# Altium project PCB_Power_S_M_Part.PrjPcb
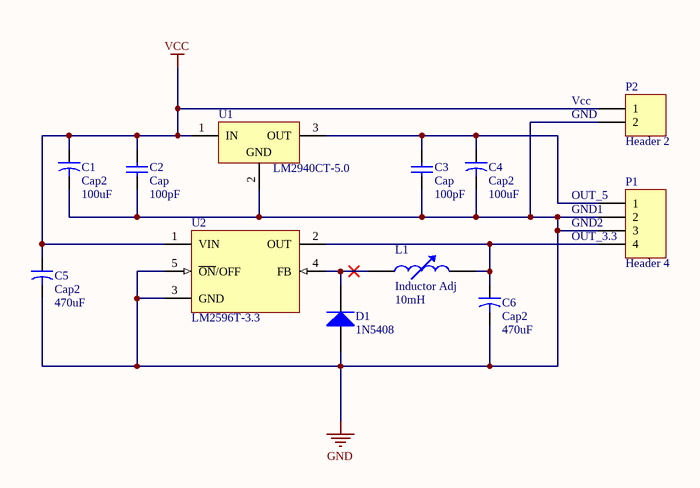
[diagram p0: Sheet1.SchDoc]
1 sheet, 12 parts. Net scope: global (net labels, ports and power ports of the same name join across sheets).

## Sheet Sheet1.SchDoc
size A4

### Parts
C1  Cap2  value 100uF  [CAPR5-4X5]
C2  Cap  value 100pF  [RAD-0.3]
C3  Cap  value 100pF  [RAD-0.3]
C4  Cap2  value 100uF  [CAPR5-4X5]
C5  Cap2  value 470uF  [CAPR5-4X5]
C6  Cap2  value 470uF  [CAPR5-4X5]
D1  1N5408  [DO-201AD]
L1  Inductor Adj  value 10mH  [AXIAL-0.8]
P1  Header 4  [HDR1X4]
P2  Header 2  [HDR1X2]
U1  LM2940CT-5.0  [T03B]
U2  LM2596T-3.3  [T05D]

### Nets
GND: C1.2 C2.1 C3.1 C4.2 C5.2 C6.2 D1.1(A) P1.2 P1.3 P2.2 U1.2(GND) U2.3(GND) U2.5(~{ON}/OFF)
VCC: C1.1 C2.2 C5.1 P2.1 U1.1(IN) U2.1(VIN)
NetC3_2: C3.2 C4.1 P1.1 U1.3(OUT)
NetC6_1: C6.1 L1.2 P1.4 U2.2(OUT)
NetD1_2: D1.2(K) L1.1 U2.4(FB)

### Notes on the sheet
- (near P2) Vcc
- (near P2) GND
- (near P1) GND1
- (near P1) OUT_5
- (near P1) GND2
- (near P1) OUT_3.3

### Library data of the parts
C1 C4-C6 = Cap2: Capacitor; Published: 23-Sep-2002; PackageReference: CAPR5-4X5; Publisher: Altium Limited; PackageDescription: Capacitor; 2 Leads
C2 C3 = Cap: Capacitor; Published: 8-Jun-2000; LatestRevisionDate: 17-Jul-2002; LatestRevisionNote: Re-released for DXP Platform.; PackageReference: RAD-0.3; Publisher: Altium Limited; PackageDescription: Radial Cap, Thru-Hole; 2 Leads; 0.3 in Pin Spacing
D1 = 1N5408: 3 Amp Medium Power Silicon Rectifier Diode; Published: 8-Jun-2000; LatestRevisionDate: 17-Jul-2002; LatestRevisionNote: Re-released for DXP Platform.; DatasheetVersion: Aug-1984; PackageReference: DO-201AD; Publisher: Altium Limited; PackageDescription: Diode, Axial; Body 9.5 x 5.3 mm (LxDia. max), Lead Dia. 1.32 mm (max); ComponentLink1Description: Manufacturer Link; ComponentLink1URL: http://www.irf.com/
L1 = Inductor Adj: Adjustable Inductor; Set Position: 0.5; Published: 24-Mar-1999; LatestRevisionDate: 17-Jul-2002; LatestRevisionNote: Re-released for DXP Platform.; PackageReference: AXIAL-0.8; Publisher: Altium Limited; PackageDescription: Axial Device, Thru-Hole; 2 Leads; 0.8 in Pin Spacing
P1 = Header 4: Header, 4-Pin; LatestRevisionDate: 17-Jul-2002; LatestRevisionNote: Re-released for DXP Platform.; Publisher: Altium Limited
P2 = Header 2: Header, 2-Pin; LatestRevisionDate: 17-Jul-2002; LatestRevisionNote: Re-released for DXP Platform.; Publisher: Altium Limited
U1 = LM2940CT-5.0: 1A Low Dropout Regulator, 3-pin TO-220; Manufacturer: National Semiconductor; PackageTopMarking: NSUZXYTTE#*LM2940CT*-5.0 P+; PowerWise: N; CompType: LDO IC; Published: 4-Dec-2008; DatasheetVersion: Jan-2007; PackageVersion: revL, Jan-1992; PackageReference: T03B; Publisher: Altium Limited; PackageDescription: TO-220, Molded, 3 Lead, Straight; Supplier 1: Farnell; Supplier Part Number 1: 9490191; Supplier 2: Farnell; Supplier Part Number 2: 1523853; PartNumber: LM2940CT-5.0; RoHS: N; PinCount: 3; ComponentLink1Description: LM2940C Datasheet; ComponentLink1URL: http://www.national.com/ds/LM/LM2940C.pdf; ComponentLink2Description: LM2940C Web Page; ComponentLink2URL: http://www.national.com/pf/LM/LM2940C.html; ComponentLink3Description: T03B Package Page; ComponentLink3URL: http://www.national.com/packaging/folders/t03b.html
U2 = LM2596T-3.3: SIMPLE SWITCHER?Power Converter 150 KHz 3A Step-Down Voltage Regulator, 5-pin TO-220; Manufacturer: National Semiconductor; PackageTopMarking: NSUZXYTTE#*LM2596T*-3.3 P+; PowerWise: N; Published: 4-Dec-2008; DatasheetVersion: May-2002; PackageVersion: revA, Oct-1989; PackageReference: T05D; Publisher: Altium Limited; PackageDescription: TO-220, Molded, Stagger Bend, 5 Lead; Supplier 1: Farnell; Supplier Part Number 1: 4466380; PartNumber: LM2596T-3.3; RoHS: N; PinCount: 5; CompType: Switcher; ComponentLink1Description: LM2596 Datasheet; ComponentLink1URL: http://www.national.com/ds/LM/LM2596.pdf; ComponentLink2Description: LM2596 Web Page; ComponentLink2URL: http://www.national.com/pf/LM/LM2596.html; ComponentLink3Description: T05D Package Page; ComponentLink3URL: http://www.national.com/packaging/folders/t05d.html